# Altium schematic sheet DRV8301.SchDoc (part 1 of 3)
size A3; SheetNumber: 4; SheetTotal: 5
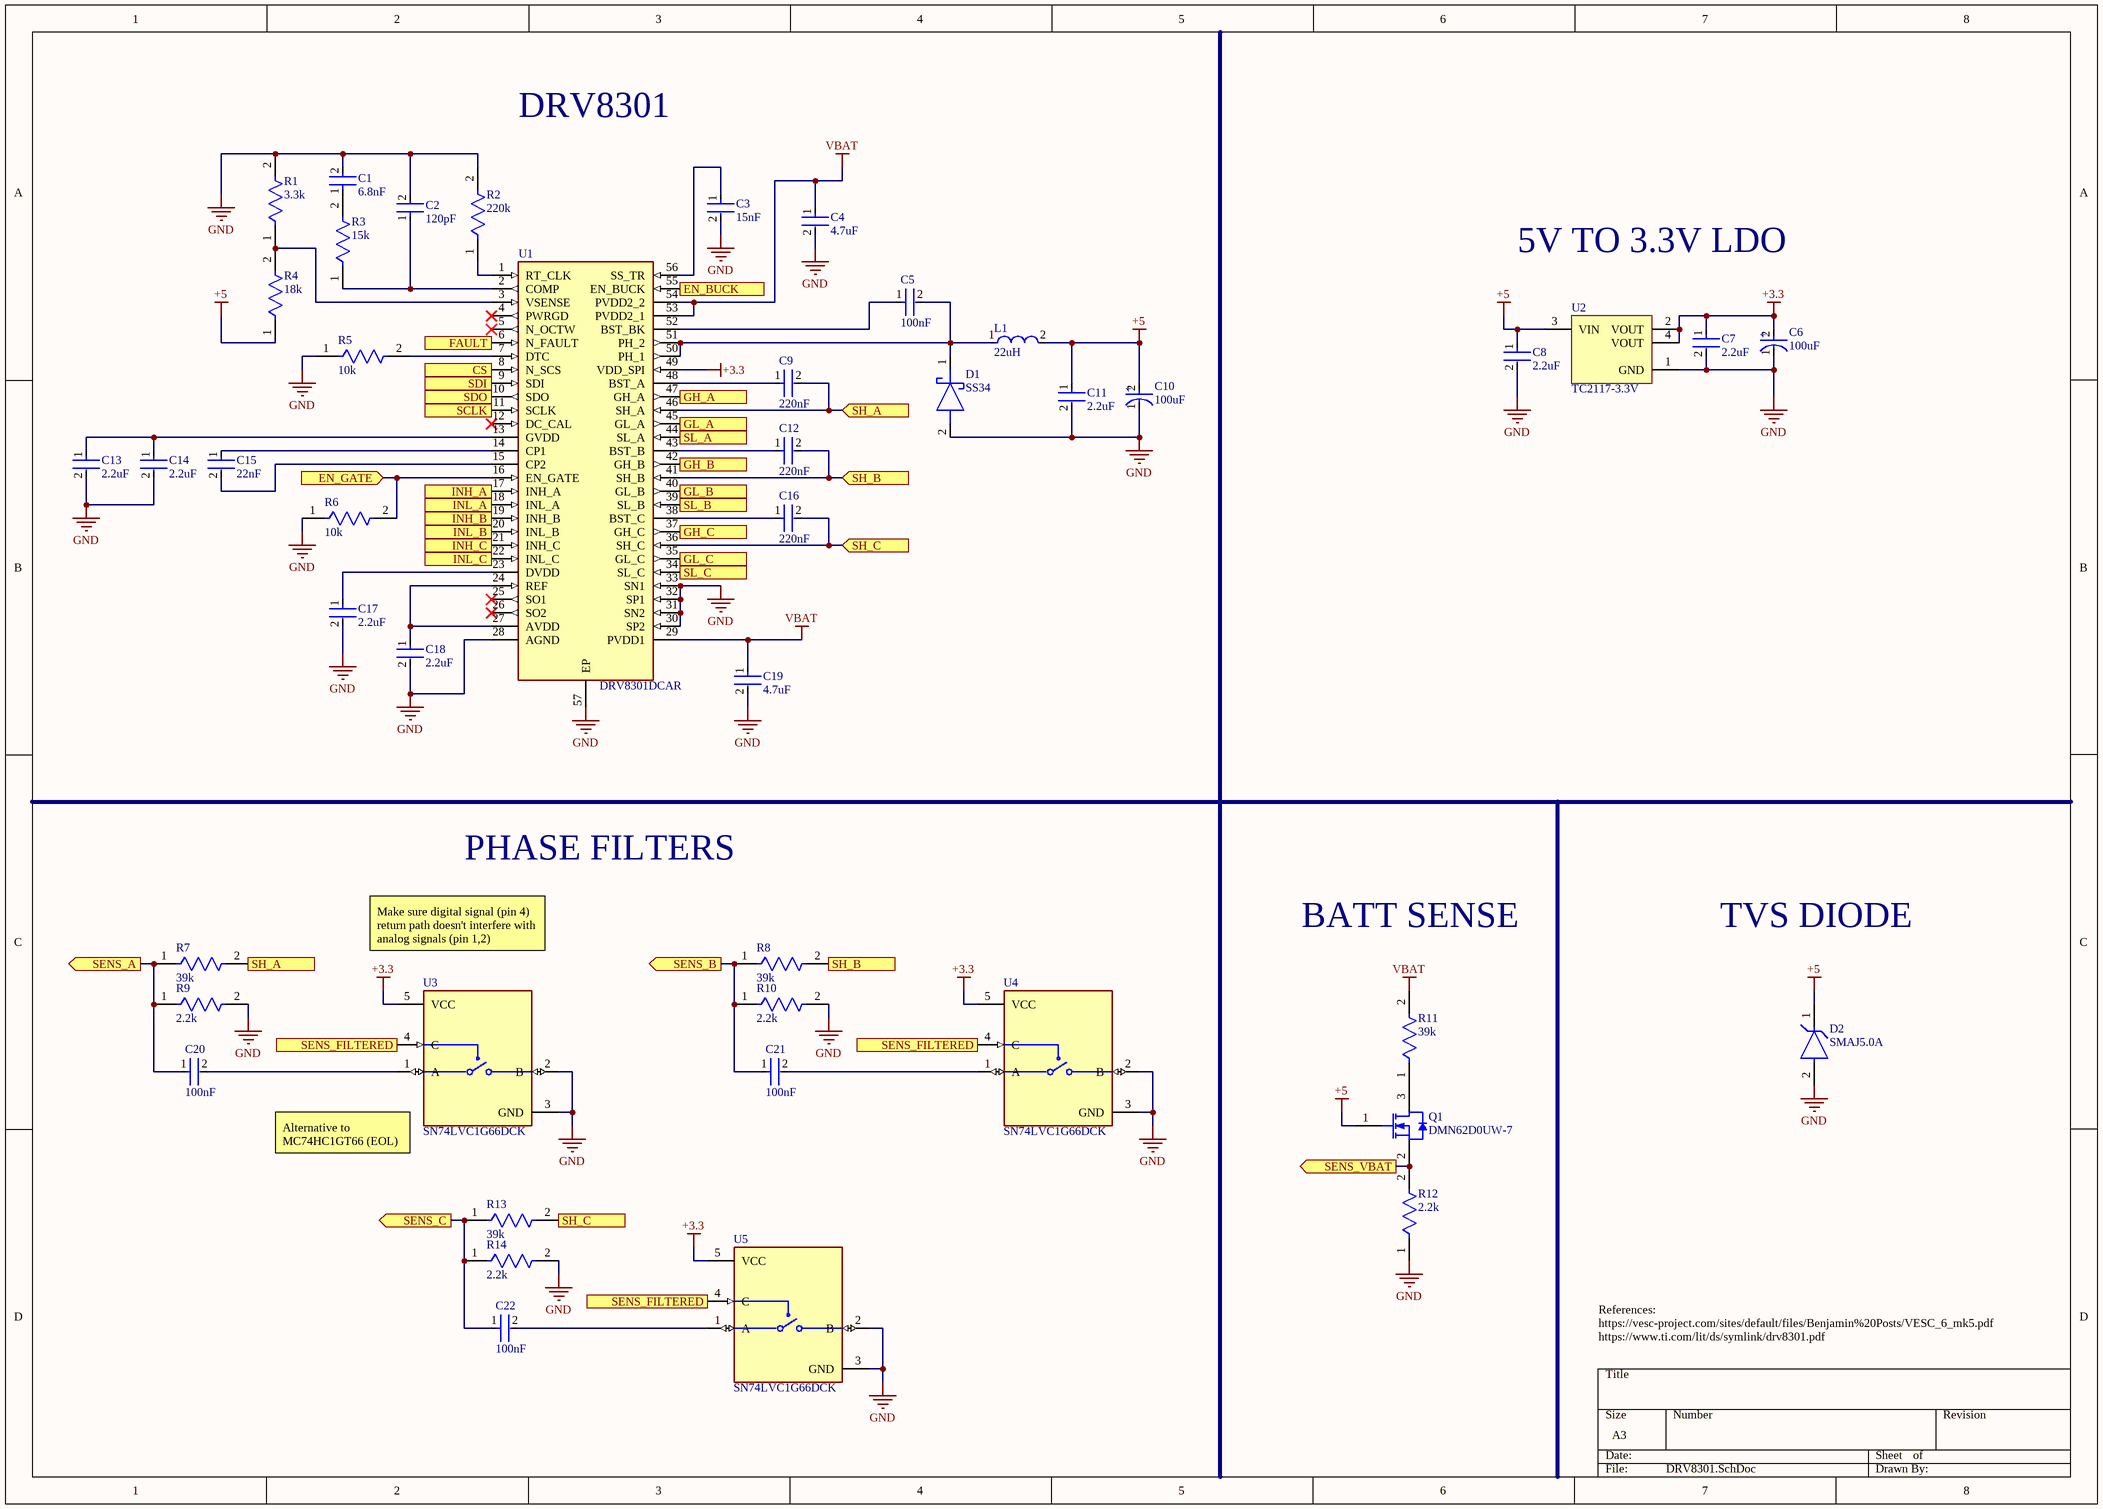
[diagram p0: DRV8301.SchDoc]

## Parts
C1  6.8nF  [FP-CC0402-MFG]
C2  120pF  [FP-CC0402-MFG]
C3  15nF  [FP-CC0402-MFG]
C4  4.7uF  [FP-CC0805-0_85-MFG]
C5  100nF  [FP-CC0402-MFG]
C6  100uF  [FP-TAJD-MFG]
C7  2.2uF  [FP-CC0805-0_85-MFG]
C8  2.2uF  [FP-CC0805-0_85-MFG]
C9  220nF  [FP-CC0603-DA-MFG]
C10  100uF  [FP-TAJD-MFG]
C11  2.2uF  [FP-CC0805-0_85-MFG]
C12  220nF  [FP-CC0603-DA-MFG]
C13  2.2uF  [FP-CC0805-0_85-MFG]
C14  2.2uF  [FP-CC0805-0_85-MFG]
C15  22nF  [FP-CC0402-MFG]
C16  220nF  [FP-CC0603-DA-MFG]
C17  2.2uF  [FP-CC0805-0_85-MFG]
C18  2.2uF  [FP-CC0805-0_85-MFG]
C19  4.7uF  [FP-CC0805-0_85-MFG]
C20  100nF  [FP-CC0402-MFG]
C21  100nF  [FP-CC0402-MFG]
C22  100nF  [FP-CC0402-MFG]
D1  SS34  [FP-SMA-MFG]
D2  SMAJ5.0A  [FP-SMA-MFG]
L1  22uH  [NR8040T220M]
Q1  DMN62D0UW-7  [SOT-323]
R1  3.3k  [FP-AC0402-MFG]
R2  220k  [FP-AC0402-MFG]
R3  15k  [FP-AC0402-MFG]
R4  18k  [FP-AC0402-MFG]
R5  10k  [FP-AC0402-MFG]
R6  10k  [FP-AC0402-MFG]
R7  39k  [FP-AC0402-MFG]
R8  39k  [FP-AC0402-MFG]
R9  2.2k  [FP-AC0402-MFG]
R10  2.2k  [FP-AC0402-MFG]
R11  39k  [FP-AC0402-MFG]
R12  2.2k  [FP-AC0402-MFG]
R13  39k  [FP-AC0402-MFG]
R14  2.2k  [FP-AC0402-MFG]
U1  DRV8301DCAR  [SOP50P810X120-57N]
U2  TC2117-3.3V  [SOT-223_N]
U3  SN74LVC1G66DCK  [FP-DCK0005A-MFG]
U4  SN74LVC1G66DCK  [FP-DCK0005A-MFG]
U5  SN74LVC1G66DCK  [FP-DCK0005A-MFG]

## Ports
CS (in, see Main[3B]), EN_BUCK (in, see Main[4A]), EN_GATE (in, see Main[3B], MCU[2B]), FAULT (in, see Main[3B], MCU[2B]), GH_A (out, see Main[4A], Power[7D]), GH_B (out, see Main[4B], Power[4D]), GH_C (out, see Main[4B], Power[2D]), GL_A (out, see Main[4B], Power[7C]), GL_B (out, see Main[4B], Power[4C]), GL_C (out, see Main[4B], Power[2C]), INH_A (in, see Main[3A]), INH_B (in, see Main[3A]), INH_C (in, see Main[3A]), INL_A (in, see Main[3A]), INL_B (in, see Main[3A]), INL_C (in, see Main[3A]), SCLK (in, see Main[3B]), SDI (in, see Main[3B]), SDO (out, see Main[3B]), SENS_A (out, see Main[3B]), SENS_B (out, see Main[3B]), SENS_C (out, see Main[3B]), SENS_FILTERED (in, see Main[3B]), SENS_VBAT (out, see Main[3B]), SH_A (in, see Main[4B], Power[7D]), SH_B (in, see Main[4B], Power[4D]), SH_C (in, see Main[4B], Power[1D]), SL_A (in, see Main[4B]), SL_B (in, see Main[4B]), SL_C (in, see Main[4B])

## Nets
+3.3: C6.2(A) C7.1 U1.49(VDD_SPI) U2.2(VOUT) U2.4(VOUT) U3.5(VCC) U4.5(VCC) U5.5(VCC)
+5: C8.1 C10.2(A) C11.1 D2.1(C) L1.2 Q1.1(G) R4.1 U2.3(VIN)
GND: C1.2 C2.2 C3.2 C4.2 C6.1(C) C7.2 C8.2 C10.1(C) C11.2 C13.2 C14.2 C17.2 C18.2 C19.2 D1.2(A) D2.2(A) R1.2 R2.2 R5.1 R6.1 R9.2 R10.2 R12.1 R14.2 U1.28(AGND) U1.30(SP2) U1.31(SN2) U1.32(SP1) U1.33(SN1) U1.57(EP) U2.1(GND) U3.2(B) U3.3(GND) U4.2(B) U4.3(GND) U5.2(B) U5.3(GND)
VBAT: C4.1 C19.1 R11.2 U1.29(PVDD1) U1.53(PVDD2_1) U1.54(PVDD2_2)
CS: U1.8(N_SCS) ; port CS
EN_BUCK: U1.55(EN_BUCK) ; port EN_BUCK
EN_GATE: R6.2 U1.16(EN_GATE) ; port EN_GATE
FAULT: U1.6(N_FAULT) ; port FAULT
GH_A: U1.47(GH_A) ; port GH_A
GH_B: U1.42(GH_B) ; port GH_B
GH_C: U1.37(GH_C) ; port GH_C
GL_A: U1.45(GL_A) ; port GL_A
GL_B: U1.40(GL_B) ; port GL_B
GL_C: U1.35(GL_C) ; port GL_C
INH_A: U1.17(INH_A) ; port INH_A
INH_B: U1.19(INH_B) ; port INH_B
INH_C: U1.21(INH_C) ; port INH_C
INL_A: U1.18(INL_A) ; port INL_A
INL_B: U1.20(INL_B) ; port INL_B
INL_C: U1.22(INL_C) ; port INL_C
SCLK: U1.11(SCLK) ; port SCLK
SDI: U1.9(SDI) ; port SDI
SDO: U1.10(SDO) ; port SDO
SENS_A: C20.1 R7.1 R9.1 ; port SENS_A
SENS_B: C21.1 R8.1 R10.1 ; port SENS_B
SENS_C: C22.1 R13.1 R14.1 ; port SENS_C
SENS_FILTERED: U3.4(C) U4.4(C) U5.4(C) ; port SENS_FILTERED
SENS_VBAT: Q1.2(S) R12.2 ; port SENS_VBAT
SH_A: C9.2 R7.2 U1.46(SH_A) ; port SH_A
SH_B: C12.2 R8.2 U1.41(SH_B) ; port SH_B
SH_C: C16.2 R13.2 U1.36(SH_C) ; port SH_C
SL_A: U1.44(SL_A) ; port SL_A
SL_B: U1.39(SL_B) ; port SL_B
SL_C: U1.34(SL_C) ; port SL_C
NetC1_1: C1.1 R3.2
NetC2_1: C2.1 R3.1 U1.2(COMP)
NetC3_1: C3.1 U1.56(SS_TR)
NetC5_1: C5.1 U1.52(BST_BK)
NetC5_2: C5.2 D1.1(K) L1.1 U1.50(PH_1) U1.51(PH_2)
NetC9_1: C9.1 U1.48(BST_A)
NetC12_1: C12.1 U1.43(BST_B)
NetC13_1: C13.1 C14.1 U1.13(GVDD)
NetC15_1: C15.1 U1.14(CP1)
NetC15_2: C15.2 U1.15(CP2)
NetC16_1: C16.1 U1.38(BST_C)
NetC17_1: C17.1 U1.23(DVDD)
NetC18_1: C18.1 U1.24(REF) U1.27(AVDD)
NetC20_2: C20.2 U3.1(A)
NetC21_2: C21.2 U4.1(A)
NetC22_2: C22.2 U5.1(A)
NetQ1_3: Q1.3(D) R11.1
NetR1_1: R1.1 R4.2 U1.3(VSENSE)
NetR2_1: R2.1 U1.1(RT_CLK)
NetR5_2: R5.2 U1.7(DTC)

Not connected (* = marked no-connect by the designer): U1 4(PWRGD)* 5(N_OCTW)* 12(DC_CAL)* 25(SO1)* 26(SO2)*

## Notes on the sheet
- DRV8301
- 5V TO 3.3V LDO
- PHASE FILTERS
- Make sure digital signal (pin 4) return path doesn't interfere with analog signals (pin 1,2)
- BATT SENSE
- TVS DIODE
- (near U3) Alternative to MC74HC1GT66 (EOL)
- References:
  https://vesc-project.com/sites/default/files/Benjamin%20Posts/VESC_6_mk5.pdf
  https://www.ti.com/lit/ds/symlink/drv8301.pdf
- (in symbol TAJD107K016RNJ) +